# Altium schematic sheet Sheet4.SchDoc
size A3
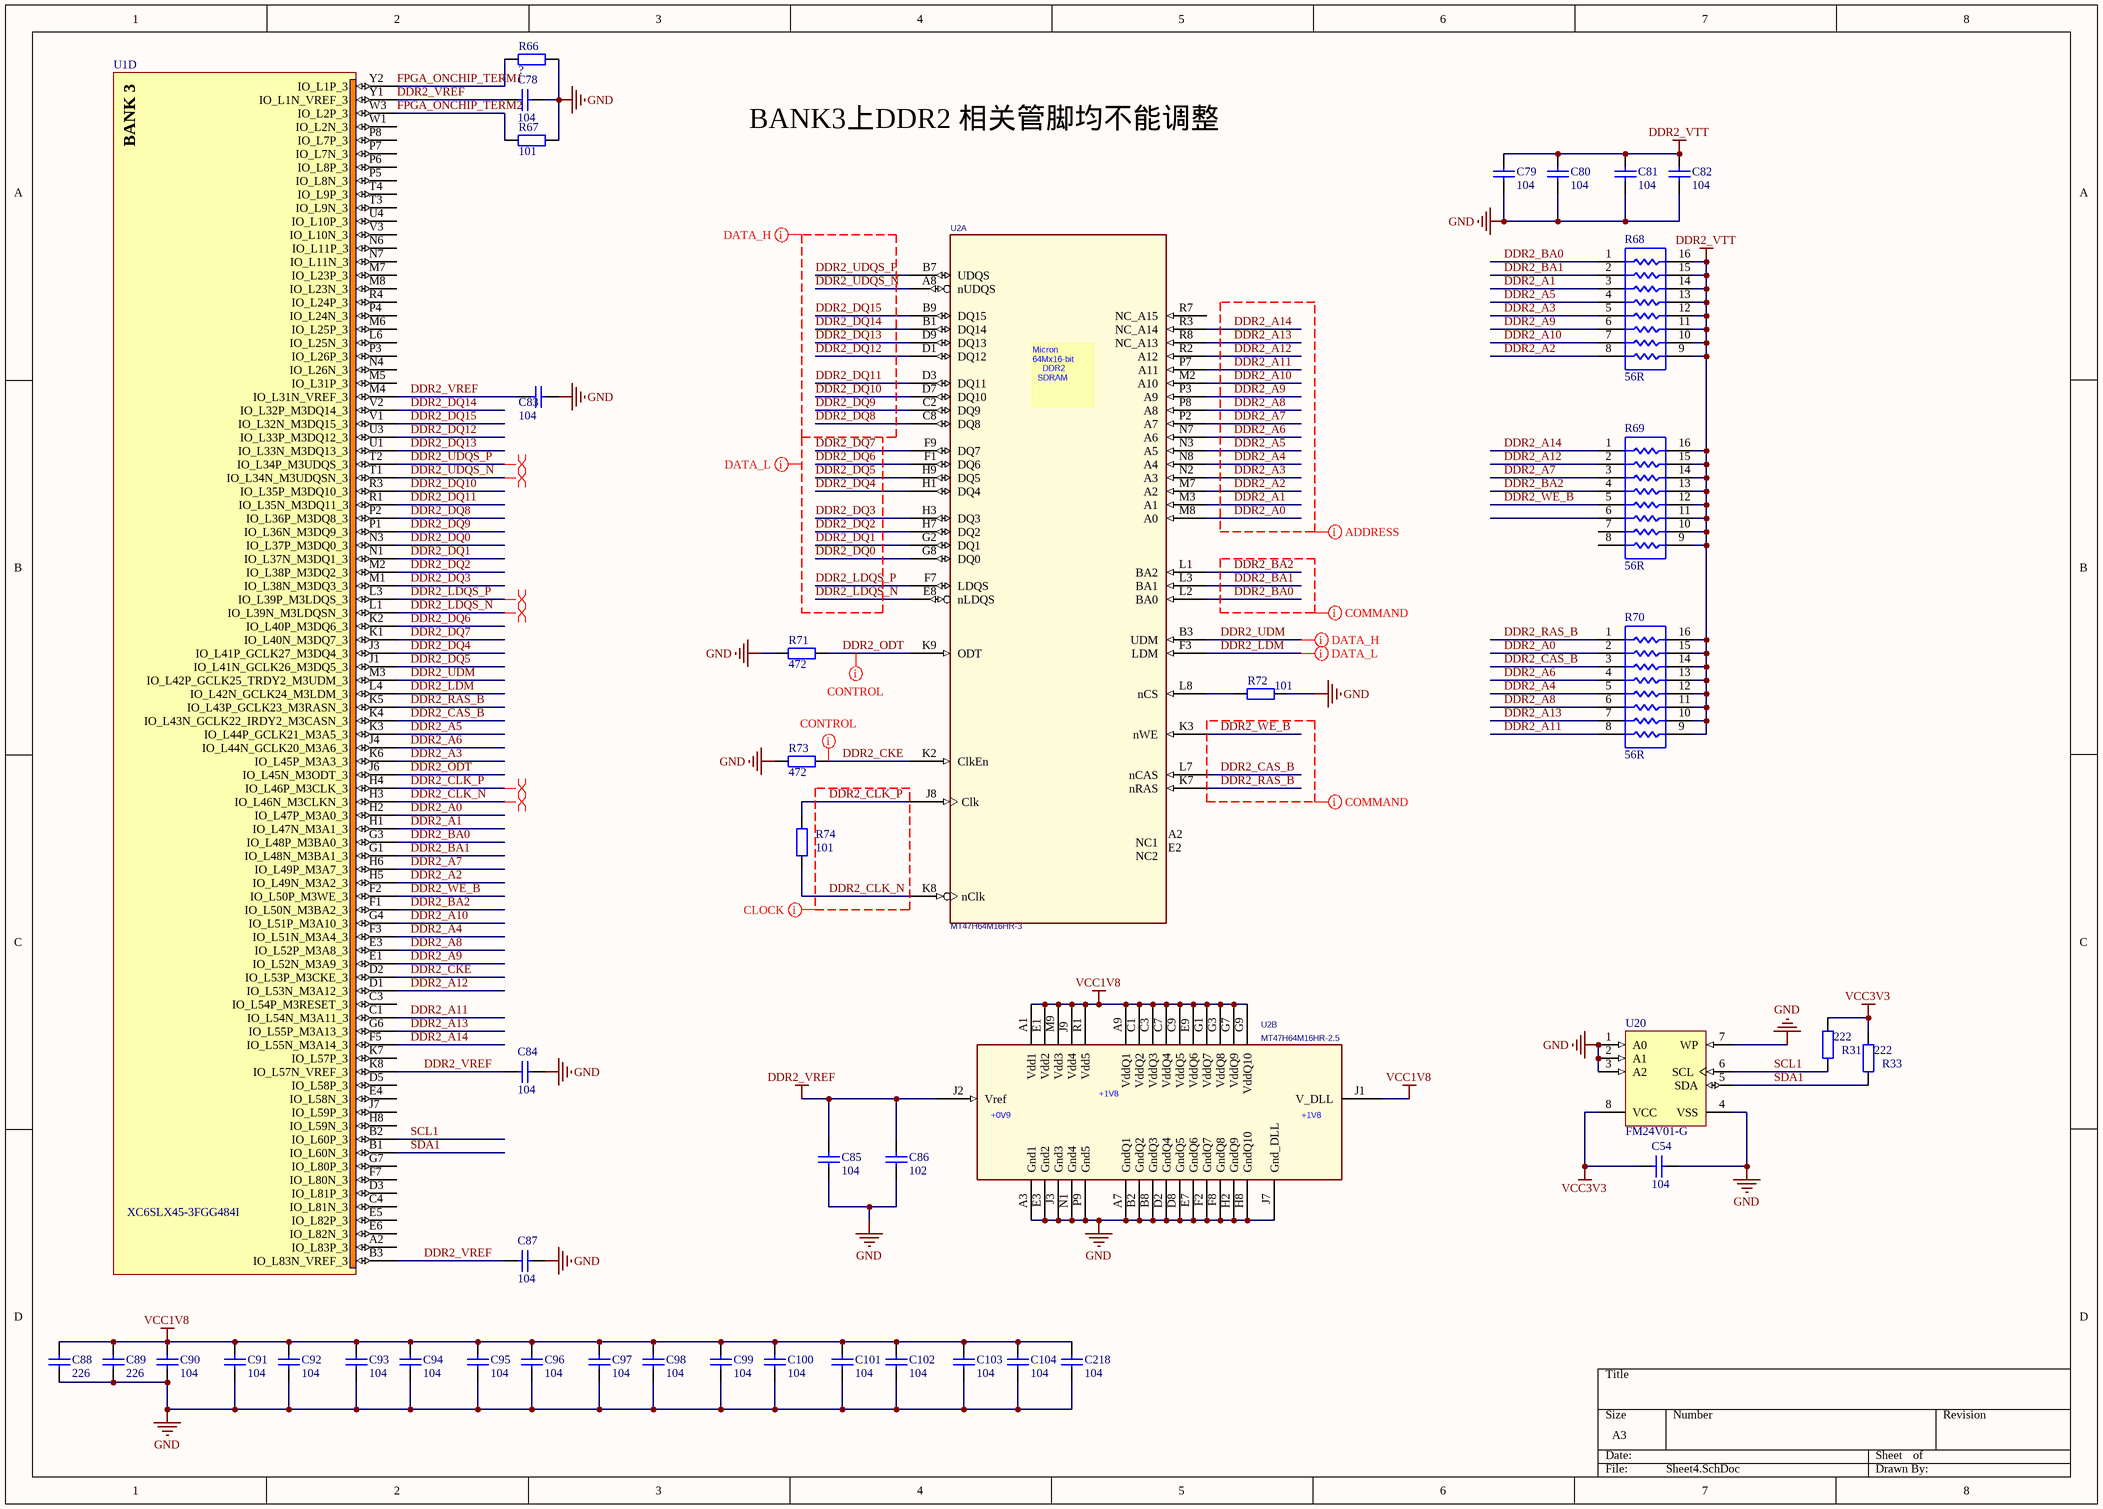
[diagram p0: Sheet4.SchDoc]

## Parts
C54  104  [0402]
C78  104  [0402]
C79  104  [0402]
C80  104  [0402]
C81  104  [0402]
C82  104  [0402]
C83  104  [0402]
C84  104  [0402]
C85  104  [0402]
C86  102  [0402]
C87  104  [0402]
C88  226  [0603]
C89  226  [0603]
C90  104  [0402]
C91  104  [0402]
C92  104  [0402]
C93  104  [0402]
C94  104  [0402]
C95  104  [0402]
C96  104  [0402]
C97  104  [0402]
C98  104  [0402]
C99  104  [0402]
C100  104  [0402]
C101  104  [0402]
C102  104  [0402]
C103  104  [0402]
C104  104  [0402]
C218  104  [0402]
R31  222  [0603]
R33  222  [0603]
R66  ?  [0603]
R67  101  [0603]
R68  56R  [RESROW_8]
R69  56R  [RESROW_8]
R70  56R  [RESROW_8]
R71  472  [0402]
R72  101  [0402]
R73  472  [0402]
R74  101  [0402]
U1  XC6SLX45-3FGG484I  [FGG484]  (part D of 8)
U2  MT47H64M16HR-3  [FBGA_84 - OK]  (parts A,B of 2)
U20  FM24V01-G  [SMD8XX]

## Nets
DDR2_VREF: C78.2 C83.2 C84.2 C85.2 C86.2 C87.2 U1.B3(IO_L83N_VREF_3) U1.K8(IO_L57N_VREF_3) U1.M4(IO_L31N_VREF_3) U1.Y1(IO_L1N_VREF_3) U2.J2(Vref)
DDR2_VTT: C79.2 C80.2 C81.2 C82.2 R68.9 R68.10 R68.11 R68.12 R68.13 R68.14 R68.15 R68.16 R69.9 R69.10 R69.11 R69.12 R69.13 R69.14 R69.15 R69.16 R70.9 R70.10 R70.11 R70.12 R70.13 R70.14 R70.15 R70.16
GND: C54.1 C78.1 C79.1 C80.1 C81.1 C82.1 C83.1 C84.1 C85.1 C86.1 C87.1 C88.1 C89.1 C90.1 C91.1 C92.1 C93.1 C94.1 C95.1 C96.1 C97.1 C98.1 C99.1 C100.1 C101.1 C102.1 C103.1 C104.1 C218.1 R66.2 R67.2 R71.1 R72.2 R73.1 U2.A3(Gnd1) U2.A7(GndQ1) U2.B2(GndQ2) U2.B8(GndQ3) U2.D2(GndQ4) U2.D8(GndQ5) U2.E3(Gnd2) U2.E7(GndQ6) U2.F2(GndQ7) U2.F8(GndQ8) U2.H2(GndQ9) U2.H8(GndQ10) U2.J3(Gnd3) U2.J7(Gnd_DLL) U2.N1(Gnd4) U2.P9(Gnd5) U20.1(A0) U20.2(A1) U20.3(A2) U20.4(VSS) U20.7(WP)
VCC1V8: C88.2 C89.2 C90.2 C91.2 C92.2 C93.2 C94.2 C95.2 C96.2 C97.2 C98.2 C99.2 C100.2 C101.2 C102.2 C103.2 C104.2 C218.2 U2.A1(Vdd1) U2.A9(VddQ1) U2.C1(VddQ2) U2.C3(VddQ3) U2.C7(VddQ4) U2.C9(VddQ5) U2.E1(Vdd2) U2.E9(VddQ6) U2.G1(VddQ7) U2.G3(VddQ8) U2.G7(VddQ9) U2.G9(VddQ10) U2.J1(V_DLL) U2.J9(Vdd4) U2.M9(Vdd3) U2.R1(Vdd5)
VCC3V3: C54.2 R31.1 R33.1 U20.8(VCC)
DDR2_A0: R70.2 U1.H2(IO_L47P_M3A0_3) U2.M8(A0)
DDR2_A1: R68.3 U1.H1(IO_L47N_M3A1_3) U2.M3(A1)
DDR2_A2: R68.8 U1.H5(IO_L49N_M3A2_3) U2.M7(A2)
DDR2_A3: R68.5 U1.K6(IO_L45P_M3A3_3) U2.N2(A3)
DDR2_A4: R70.5 U1.F3(IO_L51N_M3A4_3) U2.N8(A4)
DDR2_A5: R68.4 U1.K3(IO_L44P_GCLK21_M3A5_3) U2.N3(A5)
DDR2_A6: R70.4 U1.J4(IO_L44N_GCLK20_M3A6_3) U2.N7(A6)
DDR2_A7: R69.3 U1.H6(IO_L49P_M3A7_3) U2.P2(A7)
DDR2_A8: R70.6 U1.E3(IO_L52P_M3A8_3) U2.P8(A8)
DDR2_A9: R68.6 U1.E1(IO_L52N_M3A9_3) U2.P3(A9)
DDR2_A10: R68.7 U1.G4(IO_L51P_M3A10_3) U2.M2(A10)
DDR2_A11: R70.8 U1.C1(IO_L54N_M3A11_3) U2.P7(A11)
DDR2_A12: R69.2 U1.D1(IO_L53N_M3A12_3) U2.R2(A12)
DDR2_A13: R70.7 U1.G6(IO_L55P_M3A13_3) U2.R8(NC_A13)
DDR2_A14: R69.1 U1.F5(IO_L55N_M3A14_3) U2.R3(NC_A14)
DDR2_BA0: R68.1 U1.G3(IO_L48P_M3BA0_3) U2.L2(BA0)
DDR2_BA1: R68.2 U1.G1(IO_L48N_M3BA1_3) U2.L3(BA1)
DDR2_BA2: R69.4 U1.F1(IO_L50N_M3BA2_3) U2.L1(BA2)
DDR2_CAS_B: R70.3 U1.K4(IO_L43N_GCLK22_IRDY2_M3CASN_3) U2.L7(nCAS)
DDR2_CKE: R73.2 U1.D2(IO_L53P_M3CKE_3) U2.K2(ClkEn)
DDR2_CLK_N: R74.1 U1.H3(IO_L46N_M3CLKN_3) U2.K8(nClk)
DDR2_CLK_P: R74.2 U1.H4(IO_L46P_M3CLK_3) U2.J8(Clk)
DDR2_DQ0: U1.N3(IO_L37P_M3DQ0_3) U2.G8(DQ0)
DDR2_DQ1: U1.N1(IO_L37N_M3DQ1_3) U2.G2(DQ1)
DDR2_DQ2: U1.M2(IO_L38P_M3DQ2_3) U2.H7(DQ2)
DDR2_DQ3: U1.M1(IO_L38N_M3DQ3_3) U2.H3(DQ3)
DDR2_DQ4: U1.J3(IO_L41P_GCLK27_M3DQ4_3) U2.H1(DQ4)
DDR2_DQ5: U1.J1(IO_L41N_GCLK26_M3DQ5_3) U2.H9(DQ5)
DDR2_DQ6: U1.K2(IO_L40P_M3DQ6_3) U2.F1(DQ6)
DDR2_DQ7: U1.K1(IO_L40N_M3DQ7_3) U2.F9(DQ7)
DDR2_DQ8: U1.P2(IO_L36P_M3DQ8_3) U2.C8(DQ8)
DDR2_DQ9: U1.P1(IO_L36N_M3DQ9_3) U2.C2(DQ9)
DDR2_DQ10: U1.R3(IO_L35P_M3DQ10_3) U2.D7(DQ10)
DDR2_DQ11: U1.R1(IO_L35N_M3DQ11_3) U2.D3(DQ11)
DDR2_DQ12: U1.U3(IO_L33P_M3DQ12_3) U2.D1(DQ12)
DDR2_DQ13: U1.U1(IO_L33N_M3DQ13_3) U2.D9(DQ13)
DDR2_DQ14: U1.V2(IO_L32P_M3DQ14_3) U2.B1(DQ14)
DDR2_DQ15: U1.V1(IO_L32N_M3DQ15_3) U2.B9(DQ15)
DDR2_LDM: U1.L4(IO_L42N_GCLK24_M3LDM_3) U2.F3(LDM)
DDR2_LDQS_N: U1.L1(IO_L39N_M3LDQSN_3) U2.E8(nLDQS)
DDR2_LDQS_P: U1.L3(IO_L39P_M3LDQS_3) U2.F7(LDQS)
DDR2_ODT: R71.2 U1.J6(IO_L45N_M3ODT_3) U2.K9(ODT)
DDR2_RAS_B: R70.1 U1.K5(IO_L43P_GCLK23_M3RASN_3) U2.K7(nRAS)
DDR2_UDM: U1.M3(IO_L42P_GCLK25_TRDY2_M3UDM_3) U2.B3(UDM)
DDR2_UDQS_N: U1.T1(IO_L34N_M3UDQSN_3) U2.A8(nUDQS)
DDR2_UDQS_P: U1.T2(IO_L34P_M3UDQS_3) U2.B7(UDQS)
DDR2_WE_B: R69.5 U1.F2(IO_L50P_M3WE_3) U2.K3(nWE)
FPGA_ONCHIP_TERM1: R66.1 U1.Y2(IO_L1P_3)
FPGA_ONCHIP_TERM2: R67.1 U1.W3(IO_L2P_3)
SCL1: R31.2 U1.B2(IO_L60P_3) U20.6(SCL)
SDA1: R33.2 U1.B1(IO_L60N_3) U20.5(SDA)
NetR72_1: R72.1 U2.L8(nCS)

Not connected (* = marked no-connect by the designer): R69 6 7 8; U1 A2(IO_L83P_3) C3(IO_L54P_M3RESET_3) C4(IO_L81N_3) D3(IO_L81P_3) D5(IO_L58P_3) E4(IO_L58N_3) E5(IO_L82P_3) E6(IO_L82N_3) F7(IO_L80N_3) G7(IO_L80P_3) H8(IO_L59N_3) J7(IO_L59P_3) K7(IO_L57P_3) L6(IO_L25N_3) M5(IO_L31P_3) M6(IO_L25P_3) M7(IO_L23P_3) M8(IO_L23N_3) N4(IO_L26N_3) N6(IO_L11P_3) N7(IO_L11N_3) P3(IO_L26P_3) P4(IO_L24N_3) P5(IO_L8N_3) P6(IO_L8P_3) P7(IO_L7N_3) P8(IO_L7P_3) R4(IO_L24P_3) T3(IO_L9N_3) T4(IO_L9P_3) U4(IO_L10P_3) V3(IO_L10N_3) W1(IO_L2N_3); U2 A2(NC1) E2(NC2) R7(NC_A15)

## Layout directives
differential pair: DDR2_CLK_N, DDR2_CLK_P, DDR2_LDQS_N, DDR2_LDQS_P, DDR2_UDQS_N, DDR2_UDQS_P
net class DATA_L: DDR2_DQ0, DDR2_DQ1, DDR2_DQ2, DDR2_DQ3, DDR2_DQ4, DDR2_DQ5, DDR2_DQ6, DDR2_DQ7, DDR2_LDM, DDR2_LDQS_N, DDR2_LDQS_P
net class DATA_H: DDR2_DQ8, DDR2_DQ9, DDR2_DQ10, DDR2_DQ11, DDR2_DQ12, DDR2_DQ13, DDR2_DQ14, DDR2_DQ15, DDR2_UDM, DDR2_UDQS_N, DDR2_UDQS_P
net class ADDRESS: DDR2_A0, DDR2_A1, DDR2_A2, DDR2_A3, DDR2_A4, DDR2_A5, DDR2_A6, DDR2_A7, DDR2_A8, DDR2_A9, DDR2_A10, DDR2_A11, DDR2_A12, DDR2_A13, DDR2_A14
net class COMMAND: DDR2_BA0, DDR2_BA1, DDR2_BA2, DDR2_CAS_B, DDR2_RAS_B, DDR2_WE_B
net class CONTROL: DDR2_CKE, DDR2_ODT
net class CLOCK: DDR2_CLK_N, DDR2_CLK_P

## Notes on the sheet
- BANK3上DDR2 相关管脚均不能调整
- (in symbol DDR2 64Mx16 MT47H64M16HR-25, part A) Micron / 64Mx16-bit / DDR2 / SDRAM
- (in symbol DDR2 64Mx16 MT47H64M16HR-25, part B) +1V8; +0V9
- (in symbol XC6SLX45-3FGG484I, part D) BANK 3

## Library data of the parts
C54 C78-C104 C218 = Cap: Capacitor; Value: 0.1uF; Published: 8-Jun-2000; LatestRevisionDate: 17-Jul-2002; LatestRevisionNote: Re-released for DXP Platform.; PackageReference: RAD-0.3; Publisher: Altium Limited
R31 R33 = Res2: Resistor; Value: 2.2K; Published: 8-Jun-2000; LatestRevisionDate: 17-Jul-2002; LatestRevisionNote: Re-released for DXP Platform.; PackageReference: AXIAL-0.4; Publisher: Altium Limited
R66 = Res2: Resistor; Value: DNP; Published: 8-Jun-2000; LatestRevisionDate: 17-Jul-2002; LatestRevisionNote: Re-released for DXP Platform.; PackageReference: AXIAL-0.4; Publisher: Altium Limited
R67 R72 R74 = Res2: Resistor; Value: 100R; Published: 8-Jun-2000; LatestRevisionDate: 17-Jul-2002; LatestRevisionNote: Re-released for DXP Platform.; PackageReference: AXIAL-0.4; Publisher: Altium Limited
R68-R70 = Res Pack3: Isolated Resistor Network; Published: 24-Mar-1999; LatestRevisionDate: 29-May-2009; LatestRevisionNote: IPC-7351 Footprint Added.; PackageReference: SO-16; Publisher: Altium Limited; PackageDescription: 16-Pin Small Outline Integrated Circuit 1.27 mm Pitch; Code_JEDEC: MS-012-AC; Code_IPC: SOIC127P600-16; Value: 56R
R71 R73 = Res2: Resistor; Value: 4K7; Published: 8-Jun-2000; LatestRevisionDate: 17-Jul-2002; LatestRevisionNote: Re-released for DXP Platform.; PackageReference: AXIAL-0.4; Publisher: Altium Limited
U1 = XC6SLX45-3FGG484I: Spartan-6 LX 1.2V FPGA, 316 User I/Os, 484-Ball Fine-Pitch BGA (1.0mm Pitch), Speed Grade 3, Industrial Grade, Pb-Free; FirstPublished: 17-Nov-2009; DatasheetVersion: ver1.3, Nov-2009; PackageVersion: ver1.1, Dec-2008; PackageReference: FGG484; Publisher: Altium Limited; PackageDescription: 484-Ball Fine Pitch Ball Grid Array 1.00 mm Pitch (FGG484) - Pb-Free; Code_JEDEC: MS-034-AAJ-1; Code_IPC: BGA100P22X22-484; ComponentLink1Description: Spartan-6 Datasheet; ComponentLink1URL: http://www.xilinx.com/support/documentation/data_sheets/ds160.pdf; ComponentLink2Description: Pinout Specification; ComponentLink2URL: http://www.xilinx.com/support/documentation/user_guides/ug385.pdf; ComponentLink3Description: FGG484 Package Drawing; ComponentLink3URL: http://www.xilinx.com/support/documentation/package_specs/fg484.pdf; ComponentLink4Description: Spartan-6 Documents; ComponentLink4URL: http://www.xilinx.com/support/documentation/spartan-6.htm; ComponentLink5Description: Xilinx.com Home; ComponentLink5URL: http://www.xilinx.com
U2 = DDR2 64Mx16 MT47H64M16HR-25: 64Mx16-bit DDR2 SDRAM; Manufacturer: Micron; CLASS: IC; Notes: CL = 6 (DDR2-800); ALS Lib: L0363E; Volts: 1.8V; Type: DDR2; Case: FPGA84; Full Part No: MT47H64M16HR-25
U20 = 24LC02B-I/SN: 2Kbit, 400kHz, 2.5V, I2C Serial EEPROM, 8-Pin SOIC 150mil, Industrial Temperature; FirstPublished: 29-Jan-2009; DatasheetVersion: revJ, Feb-2009; PackageVersion: revBB, Aug-2009; PackageReference: SOIC-SN8; Publisher: Altium Limited; PackageDescription: 8-Lead Plastic Small Outline (SN) - Narrow, 3.90mm Body [SOIC]; Supplier 1: Digi-Key; Supplier Part Number 1: 24LC02B-I/SN-ND; Supplier 2: Farnell; Supplier Part Number 2: 1196818; Supplier 3: Newark; Supplier Part Number 3: 12C1997; Code_JEDEC: MS-012; Code_IPC: SOIC127P600-8; ComponentLink1Description: Datasheet; ComponentLink1URL: http://ww1.microchip.com/downloads/en/DeviceDoc/21709J.pdf; ComponentLink2Description: Packaging Specification; ComponentLink2URL: http://www.microchip.com/stellent/groups/techpub_sg/documents/packagingspec/en012702.pdf; ComponentLink3Description: Microchip.com Home; ComponentLink3URL: http://www.microchip.com/